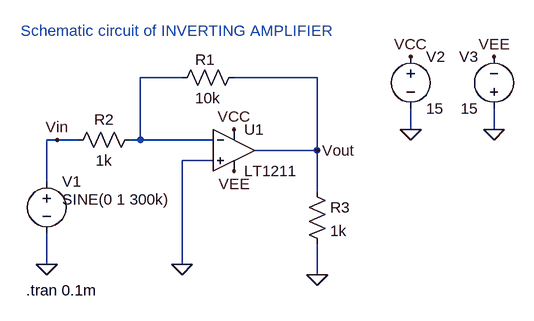
[diagram p0: schematic FFT.asc]
FFT.asc, the LTspice schematic file:
Version 4
SHEET 1 880 680
WIRE 96 48 32 48
WIRE 304 48 176 48
WIRE 448 128 448 96
WIRE 576 128 576 96
WIRE -96 144 -112 144
WIRE -64 144 -96 144
WIRE 32 144 32 48
WIRE 32 144 16 144
WIRE 144 144 32 144
WIRE 304 160 304 48
WIRE 304 160 208 160
WIRE 144 176 96 176
WIRE -112 208 -112 144
WIRE 304 224 304 160
WIRE -112 336 -112 288
WIRE 96 336 96 176
WIRE 304 352 304 304
FLAG -112 336 0
FLAG 304 352 0
FLAG 448 128 0
FLAG 576 128 0
FLAG 96 336 0
FLAG 176 128 VCC
FLAG 448 16 VCC
FLAG 176 192 VEE
FLAG 576 16 VEE
FLAG -96 144 Vin
FLAG 304 160 Vout
SYMBOL Opamps\\LT1211 176 96 R0
SYMATTR InstName U1
SYMBOL res 80 64 R270
WINDOW 0 28 52 VTop 2
WINDOW 3 0 56 VBottom 2
SYMATTR InstName R1
SYMATTR Value 10k
SYMBOL res -80 160 R270
WINDOW 0 32 56 VTop 2
WINDOW 3 0 56 VBottom 2
SYMATTR InstName R2
SYMATTR Value 1k
SYMBOL res 288 208 R0
SYMATTR InstName R3
SYMATTR Value 1k
SYMBOL voltage -112 192 R0
WINDOW 123 24 44 Left 2
WINDOW 39 0 0 Left 2
WINDOW 3 24 44 Left 2
SYMATTR Value SINE(0 1 300k)
SYMATTR InstName V1
SYMBOL voltage 448 0 R0
SYMATTR InstName V2
SYMATTR Value 15
SYMBOL voltage 576 112 R180
WINDOW 0 24 96 Left 2
WINDOW 3 24 16 Left 2
SYMATTR InstName V3
SYMATTR Value 15
TEXT -144 376 Left 2 !.tran 0.1m
TEXT -152 -24 Left 2 ;Schematic circuit of INVERTING AMPLIFIER

The netlist it stands for:
* FFT.asc
XU1 0 N001 VCC VEE Vout LT1211  ; pins In+ In- V+ V- OUT
R1 N001 Vout 10k
R2 Vin N001 1k
R3 Vout 0 1k
V1 Vin 0 SINE(0 1 300k)
V2 VCC 0 15
V3 0 VEE 15
.tran 0.1m
* Schematic circuit of INVERTING AMPLIFIER
.lib LTC.lib
.backanno
.end